# EAGLE design main (EAGLE 5.11)
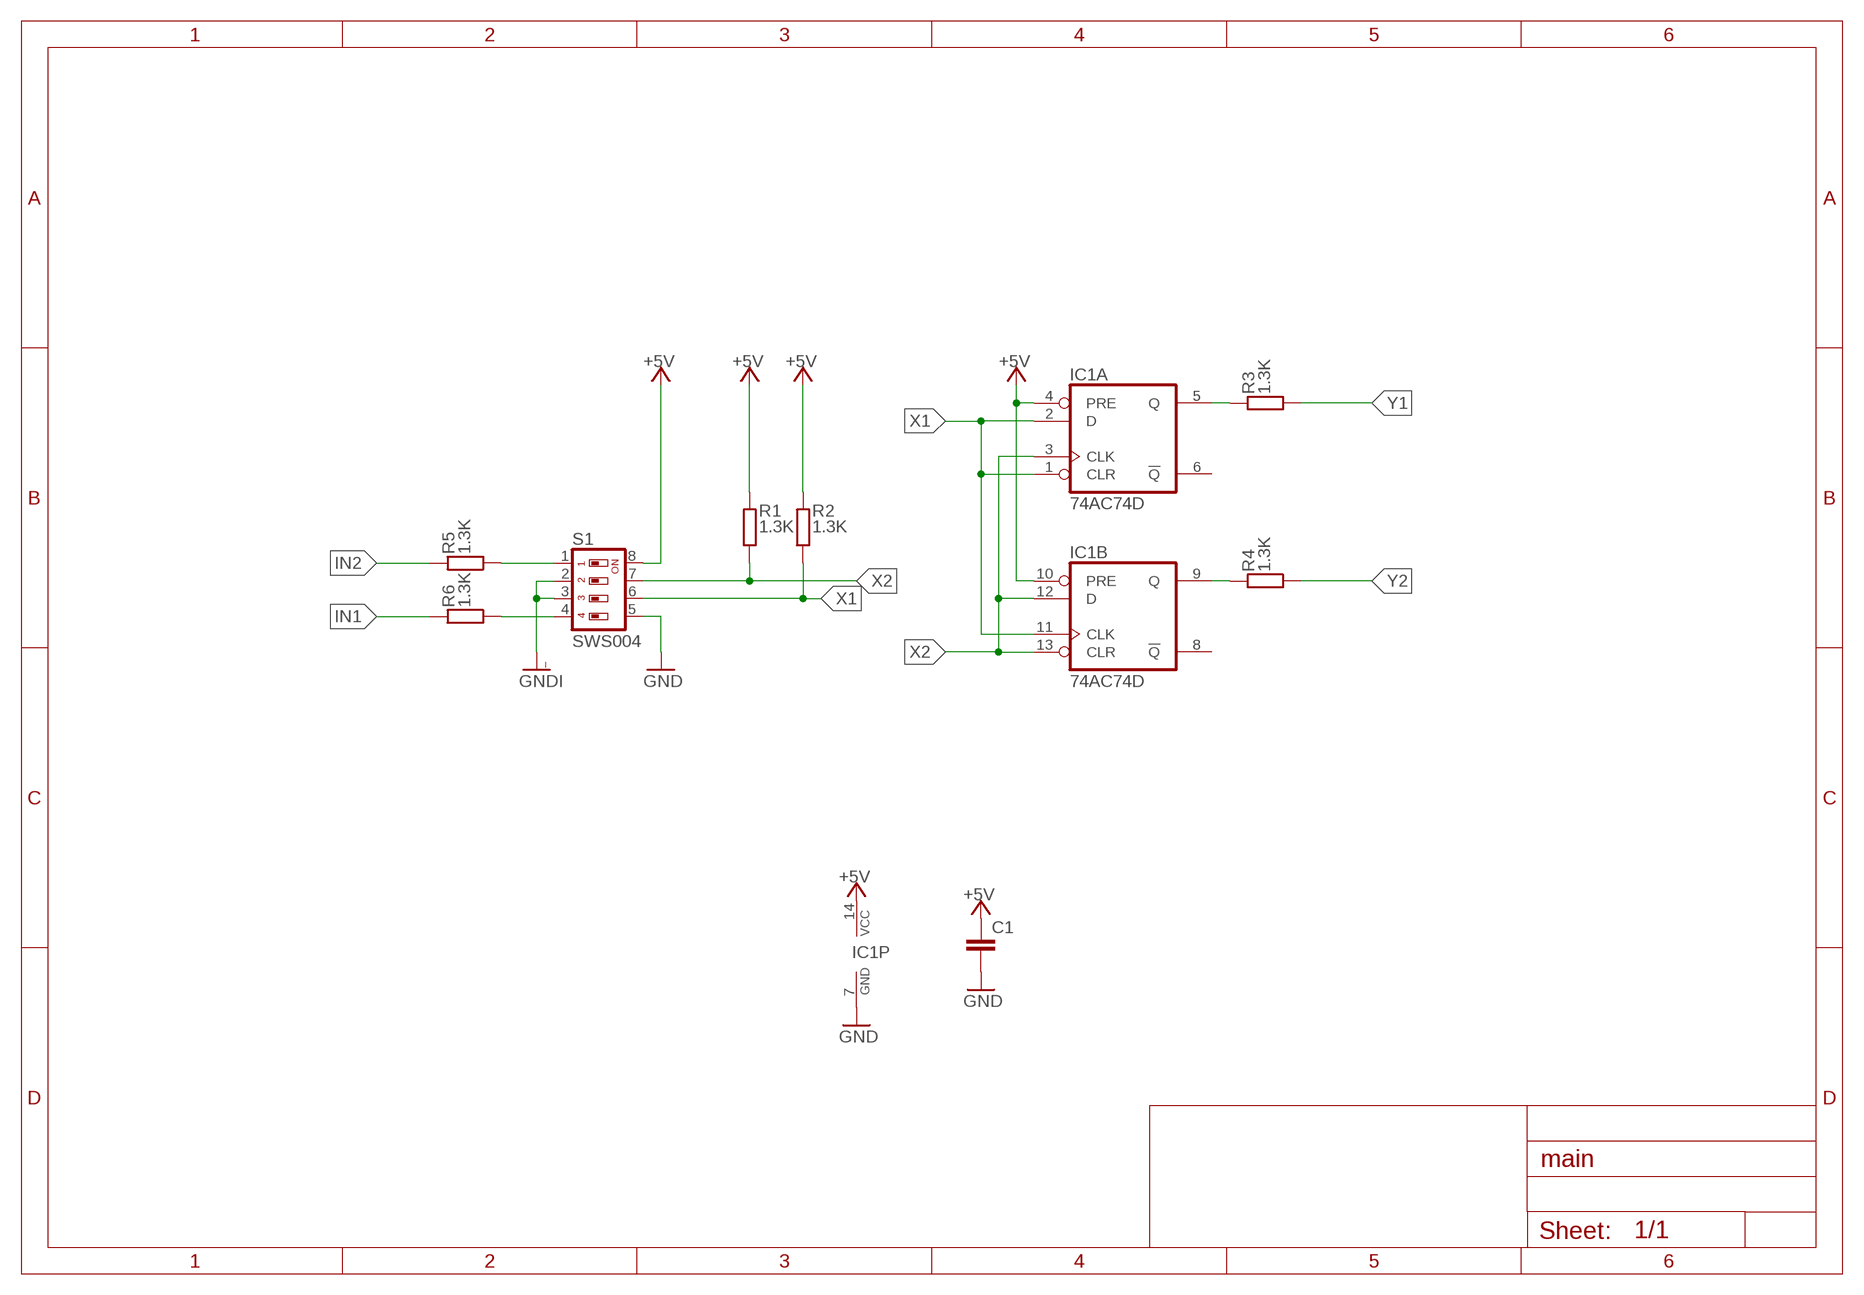
[diagram p0: schematic, sheet 1]

## Parts
C1  C-EUC0603  [C0603]
IC1  74AC74D  [SO14]
R1  1.3K  R-EU_R0603  [R0603]
R2  1.3K  R-EU_R0603  [R0603]
R3  1.3K  R-EU_R0603  [R0603]
R4  1.3K  R-EU_R0603  [R0603]
R5  1.3K  R-EU_R0603  [R0603]
R6  1.3K  R-EU_R0603  [R0603]
S1  SWS004  [SMS-004]

## Nets
+5V: C1.1 IC1.4(A:PRE) IC1.10(B:PRE) IC1.14(P:VCC) R1.2 R2.2 S1.8
GND: C1.2 IC1.7(P:GND) S1.5
GNDI: S1.2 S1.3
IN1: R6.2
IN2: R5.2
N$1: IC1.5(A:Q) R3.2
N$2: IC1.9(B:Q) R4.2
N$3: R6.1 S1.4
N$4: R5.1 S1.1
X1: IC1.1(A:CLR) IC1.2(A:D) IC1.11(B:CLK) R2.1 S1.6
X2: IC1.3(A:CLK) IC1.12(B:D) IC1.13(B:CLR) R1.1 S1.7
Y1: R3.1
Y2: R4.1
Unconnected: IC1.6(A:!Q) IC1.8(B:!Q)

## Library data of the parts
C1 = rcl:C-EU: CAPACITOR, European symbol
IC1 = 74xx-eu:74*74: Dual D type positive edge triggered FLIP FLOP, preset and clear
R1-R6 = rcl:R-EU_: RESISTOR, European symbol
S1 = smd-special:SWS004: SMD Dip Switch 4 pol.

## Board
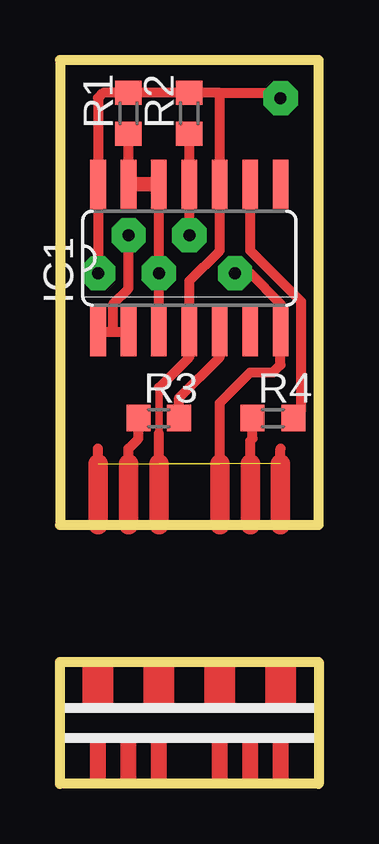
[diagram p1: board, top side]
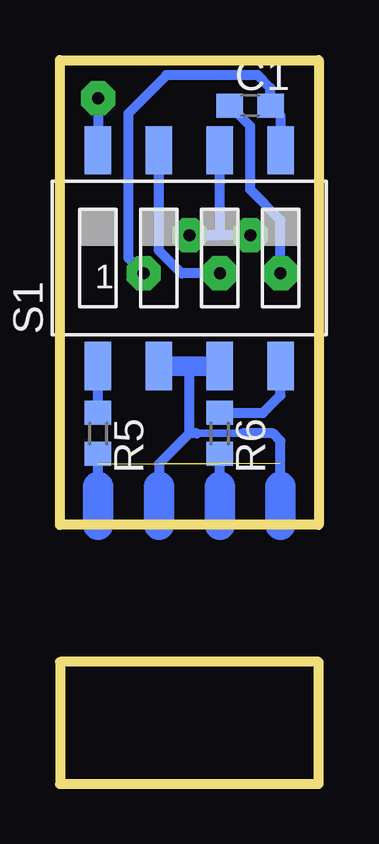
[diagram p2: board, bottom side, seen from below]

Size 10.79 x 30.16 mm. Coordinates in mm from the lower left corner, seen from the top.
Outline: 0,10.79 10.79,10.79 10.79,30.16 0,30.16 0,10.79
Outline: 0,5.08 10.79,5.08 10.79,0 0,0 0,5.08
Copper layers (1*16): Top 0.035mm / dielectric 1.5mm / Bottom 0.035mm
Design rules "default": minimum track width 10mil, minimum drill 24mil, track to track 8mil, track to pad 8mil, pad to pad 8mil, via to via 8mil, smd to smd 8mil, copper to edge 40mil, drill to drill 8mil, minimum pad ring 10mil, minimum via ring 8mil, stop-mask expansion 4mil, vias tented up to drill 0mil, thermal gap 10mil

### Footprints (pad centres in the part's own frame; a part is rotated, then mirrored left to right if it is on the bottom)
C0603 = smd 1.1 x 1: 1 -0.85,0; 2 0.85,0
SO14 = smd 0.66 x 2.032: 1 -3.81,-3.073; 2 -2.54,-3.073; 3 -1.27,-3.073; 4 0,-3.073; 5 1.27,-3.073; 6 2.54,-3.073; 7 3.81,-3.073; 8 3.81,3.073; 9 2.54,3.073; 10 1.27,3.073; 11 0,3.073; 12 -1.27,3.073; 13 -2.54,3.073; 14 -3.81,3.073
R0603 = smd 1 x 1.1: 1 -0.85,0; 2 0.85,0
SMS-004 = smd 1.092 x 2.007: 1 -3.81,-4.496; 2 -1.27,-4.496; 3 1.27,-4.496; 4 3.81,-4.496; 5 3.81,4.496; 6 1.27,4.496; 7 -1.27,4.496; 8 -3.81,4.496

### Placement (x,y rotation side)
C1  2.86,28.26 0 bottom
IC1  5.4,21.91 0 top
R1  2.86,27.94 90 top
R2  5.4,27.94 90 top
R3  4.13,15.24 0 top
R4  8.89,15.24 0 top
R5  9.21,14.61 270 bottom
R6  4.13,14.61 270 bottom
S1  5.4,21.91 0 bottom

### Tracks (layer width: path | path; a pad name or v marks a point on that pad's centre or on a via)
+5V  (via drill 0.5 pad 1.42)  (1 unrouted)
  Top 0.305: 4.13,14.61 4.13,16.51
  Top 0.406: 4.13,13.34 4.13,14.61 | 6.67,28.79 R2.2 R1.2 1.8,28.79 1.59,28.58 IC1.14 v1.59,21.27 | 6.67,28.79 8.99,28.79 v9.21,28.58 | 6.67,28.79 IC1.10 6.67,22.23 5.4,20.95 IC1.4 5.4,17.78 4.13,16.51 | 9.21,13.34 9.21,13.97
  Top 0.813: 4.13,10.79 4.13,13.34 | 9.21,10.79 9.21,13.34
  Bottom 0.406: v9.21,28.58 S1.8 | v1.59,21.27 1.59,23.49 2.86,24.77 2.86,27.41 C1.1
GND  (via drill 0.5 pad 1.42)  (1 unrouted)
  Top 0.406: 1.59,13.34 1.59,13.97 | 6.67,13.34 6.67,15.88 7.94,17.14 8.89,17.14 9.21,17.46 IC1.7 9.21,20 7.94,21.27 v7.3,21.27
  Top 0.813: 1.59,10.79 1.59,13.34 | 6.67,10.79 6.67,13.34
  Bottom 0.406: v7.3,21.27 7.94,21.91 7.94,27.94 6.35,29.53 2.54,29.53 2.01,28.99 C1.2 1.59,27.84 S1.5
GNDI
  Bottom 0.305: 3.17,14.61 5.08,14.61
  Bottom 0.406: 5.4,14.61 6.67,13.34 6.67,12.38 | S1.2 5.66,17.41 5.4,17.14 5.4,14.61 | 1.59,12.38 1.59,14.29 1.91,14.61 3.17,14.61 | 5.08,14.61 5.4,14.61
  Bottom 0.813: S1.2 S1.3
  Bottom 1.27: 1.59,12.38 1.59,10.79 | 6.67,12.38 6.67,10.79
IN1
  Bottom 0.406: 4.13,12.38 R6.2
  Bottom 1.27: 4.13,12.38 4.13,10.79
IN2
  Bottom 0.406: 9.21,12.38 R5.2
  Bottom 1.27: 9.21,12.38 9.21,10.79
N$1
  Top 0.406: IC1.5 6.67,17.78 4.98,16.09 R3.2
N$2
  Top 0.406: IC1.9 7.94,22.23 10.06,20.11 10.06,15.56 R4.2
N$3
  Bottom 0.406: S1.4 1.59,16.19 2.33,15.46 R6.1
N$4
  Bottom 0.406: R5.1 S1.1
X1  (via drill 0.5 pad 1.42)
  Top 0.406: v5.4,22.86 IC1.11 R2.1 | v2.86,22.86 2.86,20.64 2.22,20 2.22,18.83 | IC1.1 2.22,18.83 | 2.22,18.83 IC1.2
  Bottom 0.406: v2.86,22.86 v5.4,22.86 4.13,22.86 S1.6
X2  (via drill 0.5 pad 1.42)
  Top 0.406: IC1.3 v4.13,21.27 IC1.12 | IC1.13 R1.1
  Top 0.61: IC1.12 IC1.13
  Bottom 0.406: S1.7 6.67,22.23 5.71,21.27 v4.13,21.27
Y1
  Top 0.406: 2.86,13.34 2.86,13.97 3.28,14.39 R3.1
  Top 0.813: 2.86,10.79 2.86,13.34
Y2
  Top 0.406: 7.94,13.34 7.94,14.29 8.04,14.39 R4.1
  Top 0.813: 7.94,10.79 7.94,13.34
(copper drawn outside any net)
  shapes: Top area x10